# Altium project Controller.PrjPcb (part 3 of 4)

## Sheet Power adapter.SchDoc
size A4; SheetNumber: 3; SheetTotal: 7
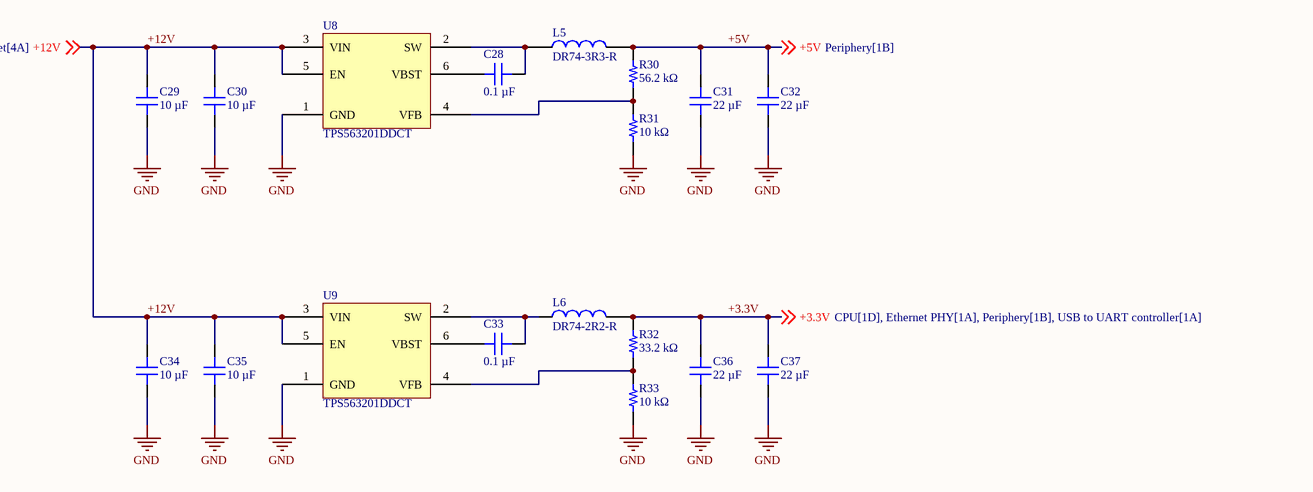
[diagram p2: Power adapter.SchDoc]

### Parts
C28  0.1 µF  [CAP 0603_1608]
C29  10 µF  [CAP 0805_2012]
C30  10 µF  [CAP 0805_2012]
C31  22 µF  [CAP 1206_3216 - 0.8MM]
C32  22 µF  [CAP 1206_3216 - 0.8MM]
C33  0.1 µF  [CAP 0603_1608]
C34  10 µF  [CAP 0805_2012]
C35  10 µF  [CAP 0805_2012]
C36  22 µF  [CAP 1206_3216 - 0.8MM]
C37  22 µF  [CAP 1206_3216 - 0.8MM]
L5  DR74-3R3-R  [INDPM7676X435N]
L6  DR74-2R2-R  [INDPM7676X435N]
R30  56.2 kΩ  [RES 0603_1608]
R31  10 kΩ  [RES 0603_1608]
R32  33.2 kΩ  [RES 0603_1608]
R33  10 kΩ  [RES 0603_1608]
U8  TPS563201DDCT  [TI SOT-23-6 DDC]
U9  TPS563201DDCT  [TI SOT-23-6 DDC]

### Nets
+3.3V: C36.2 C37.2 L6.2 R32.2 ; off-sheet +3.3V
+5V: C31.2 C32.2 L5.2 R30.2 ; off-sheet +5V
+12V: C29.1 C29.2 C30.1 C30.2 C31.1 C32.1 C34.1 C34.2 C35.1 C35.2 C36.1 C37.1 R31.1 R33.1 U8.1(GND) U8.3(VIN) U8.5(EN) U9.1(GND) U9.3(VIN) U9.5(EN) ; off-sheet +12V  [also labelled GND]
NetC28_1: C28.1 L5.1 U8.2(SW)
NetC28_2: C28.2 U8.6(VBST)
NetC33_1: C33.1 L6.1 U9.2(SW)
NetC33_2: C33.2 U9.6(VBST)
NetR30_1: R30.1 R31.2 U8.4(VFB)
NetR32_1: R32.1 R33.2 U9.4(VFB)

### Library data of the parts
C28 C33 = C1608X7R1H104K080AE: CAP CER 0.1UF 50V X7R 0603; manufacturer: TDK Corporation; Tolerance: ±10%; Part Number: C1608X7R1H104K080AE; Capacitance: 0.1 µF; Applications: Boardflex Sensitive; componentlink1description: Datasheet; componentlink1url: https://product.tdk.com/info/en/catalog/datasheets/mlcc_commercial_soft_en.pdf?ref_disty=digikey; componentlink2description: DigiKey Link; componentlink2url: https://www.digikey.com/en/products/detail/tdk-corporation/C1608X7R1H104K080AE/4490564; Device Package: 0603 (1608 Metric); Features: Soft Termination; lastupdated: 9.02.2024 20:10:17; Lifecycle Status: Active; Minimum Order: 1; Mounting Type: Surface Mount, MLCC; Operating Temperature: -55°C ~ 125°C; Package / Case: 0603 (1608 Metric); packaging: TapeAndReel; partid: 12789; Part Status: Active; price: 0.02; series: C; Size / Dimension: 0.063" L x 0.031" W (1.60mm x 0.80mm); Supplier 1: DigiKey; Supplier Part Number 1: 445-15927-6-ND; Temperature Coefficient: X7R; Thickness (Max): 0.037" (0.95mm); value: 0.1 µF; Voltage - Rated: 50V
C29 C30 C34 C35 = CL21B106KOQNNNE: CAP CER 10UF 16V X7R 0805; manufacturer: Samsung Electro-Mechanics; Tolerance: ±10%; Part Number: CL21B106KOQNNNE; Capacitance: 10 µF; Applications: General Purpose; componentlink1description: Datasheet; componentlink1url: http://www.samsungsem.com/kr/support/product-search/mlcc/CL21B106KOQNNNE.jsp; componentlink2description: DigiKey Link; componentlink2url: https://www.digikey.com/en/products/detail/samsung-electro-mechanics/CL21B106KOQNNNE/3888530; Device Package: 0805 (2012 Metric); lastupdated: 9.02.2024 20:15:41; Lifecycle Status: Active; Minimum Order: 1; Mounting Type: Surface Mount, MLCC; Operating Temperature: -55°C ~ 125°C; Package / Case: 0805 (2012 Metric); packaging: TapeAndReel; partid: 40933; Part Status: Active; price: 0.03; series: CL; Size / Dimension: 0.079" L x 0.049" W (2.00mm x 1.25mm); Temperature Coefficient: X7R; Thickness (Max): 0.055" (1.40mm); value: 10 µF; Voltage - Rated: 16V; Supplier 1: DigiKey; Supplier Part Number 1: 1276-2872-1-ND; Supplier 2: TME; Supplier Part Number 2: CL21B106KOQNNNE
C31 C32 C36 C37 = CL31B226KPHNNNE: CAP CER 22UF 10V X7R 1206; manufacturer: Samsung Electro-Mechanics; Tolerance: ±10%; Part Number: CL31B226KPHNNNE; Capacitance: 22 µF; Applications: General Purpose; componentlink1description: Datasheet; componentlink1url: http://www.samsungsem.com/kr/support/product-search/mlcc/CL31B226KPHNNNE.jsp; componentlink2description: DigiKey Link; componentlink2url: https://www.digikey.com/en/products/detail/samsung-electro-mechanics/CL31B226KPHNNNE/3888427; Device Package: 1206 (3216 Metric); lastupdated: 4.06.2024 19:10:41; Lifecycle Status: Active; Minimum Order: 1; Mounting Type: Surface Mount, MLCC; Operating Temperature: -55°C ~ 125°C; Package / Case: 1206 (3216 Metric); packaging: TapeAndReel; partid: 19611; Part Status: Active; price: 0.08; series: CL; Size / Dimension: 0.126" L x 0.063" W (3.20mm x 1.60mm); Supplier 1: DigiKey; Supplier Part Number 1: 1276-2769-1-ND; Temperature Coefficient: X7R; Thickness (Max): 0.071" (1.80mm); value: 22 µF; Voltage - Rated: 10V
L5 = DR74-3R3-R: EATON COILTRONICS - DR74-3R3-R - Power Inductor (SMD), 3.3 H, 3.94 A, Shielded, 5.4 A, DR Series, 7.6mm x 7.6mm x 4.35mm; Manufacturer_Name: Eaton; Manufacturer_Part_Number: DR74-3R3-R; Mouser Part Number: 704-DR74-3R3-R; Mouser Price/Stock: https://www.mouser.co.uk/ProductDetail/Bussmann-Eaton/DR74-3R3-R?qs=yzwxPInThYRgV9ebcXY7Bg%3D%3D; Arrow Part Number: DR74-3R3-R; Arrow Price/Stock: https://www.arrow.com/en/products/dr74-3r3-r/eaton?region=nac; Datasheet Link: https://ms.componentsearchengine.com/Datasheets/2/DR74-3R3-R.pdf; Geometry.Height: 4.35mm; Supplier 1: TME; Supplier Part Number 1: DR74-3R3-R; Supplier 2: Farnell; Supplier Part Number 2: 4437558; Supplier 3: DigiKey; Supplier Part Number 3: 513-1665-6-ND
L6 = DR74-2R2-R: Fixed Inductors 2.2uH 7A 0.0126ohms; Manufacturer_Name: Eaton; Geometry.Height: 4.35mm; Manufacturer_Part_Number: DR74-2R2-R; Mouser Part Number: 704-DR74-2R2-R; Mouser Price/Stock: https://www.mouser.co.uk/ProductDetail/Eaton-Electronics/DR74-2R2-R?qs=yzwxPInThYTMNtV4%252BtE9KA%3D%3D; Arrow Part Number: DR74-2R2-R; Arrow Price/Stock: https://www.arrow.com/en/products/dr74-2r2-r/eaton; Datasheet Link: https://componentsearchengine.com/Datasheets/1/DR74-2R2-R.pdf; Supplier 1: TME; Supplier Part Number 1: DR74-2R2-R; Supplier 2: RS; Supplier Part Number 2: 7701163; Supplier 3: DigiKey; Supplier Part Number 3: 513-1140-6-ND
R30 = CRCW060356K2FKEA: RES SMD 56.2K OHM 1% 1/10W 0603; Manufacturer: Vishay Dale; Power (Watts): 0.1W, 1/10W; Resistance: 56.2 kOhms; Temperature Coefficient: ±100ppm/°C; Part Number: CRCW060356K2FKEA; Value: 56.2 kΩ; ComponentLink1Description: Datasheet; ComponentLink1URL: http://www.vishay.com/docs/20035/dcrcwe3.pdf; ComponentLink2Description: DigiKey Link; ComponentLink2URL: https://www.digikey.com/en/products/detail/vishay-dale/CRCW060356K2FKEA/1174868; Composition: Thick Film; Device Package: 0603 (1608 Metric); Features: Automotive AEC-Q200; Height - Seated (Max): 0.020" (0.50mm); LastUpdated: 9.02.2024 20:43:05; Lifecycle Status: Active; Minimum Order: 1; Number of Terminations: 2; Operating Temperature: -55°C ~ 155°C; Package / Case: 0603 (1608 Metric); Packaging: TapeAndReel; PartId: 12682; Part Status: Active; Price: 0.01; Ratings: AEC-Q200; Series: CRCW; Size / Dimension: 0.061" L x 0.033" W (1.55mm x 0.85mm); Supplier 1: DigiKey; Supplier Part Number 1: 541-56.2KHCT-ND; Supplier Device Package: 0603; Tolerance: ±1%
R31 R33 = CRCW060310K0FKEA: RES SMD 10K OHM 1% 1/10W 0603; Manufacturer: Vishay Dale; Power (Watts): 0.1W, 1/10W; Resistance: 10 kOhms; Temperature Coefficient: ±100ppm/°C; Part Number: CRCW060310K0FKEA; Value: 10 kΩ; ComponentLink1Description: Datasheet; ComponentLink1URL: http://www.vishay.com/docs/20035/dcrcwe3.pdf; ComponentLink2Description: DigiKey Link; ComponentLink2URL: https://www.digikey.com/en/products/detail/vishay-dale/CRCW060310K0FKEA/1174782; Composition: Thick Film; Device Package: 0603 (1608 Metric); Features: Automotive AEC-Q200; Height - Seated (Max): 0.020" (0.50mm); LastUpdated: 9.02.2024 20:42:10; Lifecycle Status: Active; Minimum Order: 1; Number of Terminations: 2; Operating Temperature: -55°C ~ 155°C; Package / Case: 0603 (1608 Metric); Packaging: CutTape; PartId: 24636; Part Status: Active; Price: 0.01; Ratings: AEC-Q200; Series: CRCW; Size / Dimension: 0.061" L x 0.033" W (1.55mm x 0.85mm); Supplier 1: DigiKey; Supplier Part Number 1: 541-10.0KHCT-ND; Supplier Device Package: 0603; Tolerance: ±1%
R32 = CRCW060333K2FKEA: RES SMD 33.2K OHM 1% 1/10W 0603; Manufacturer: Vishay Dale; Power (Watts): 0.1W, 1/10W; Resistance: 33.2 kOhms; Temperature Coefficient: ±100ppm/°C; Part Number: CRCW060333K2FKEA; Value: 33.2 kΩ; ComponentLink1Description: Datasheet; ComponentLink1URL: http://www.vishay.com/docs/20035/dcrcwe3.pdf; ComponentLink2Description: DigiKey Link; ComponentLink2URL: https://www.digikey.com/en/products/detail/vishay-dale/CRCW060333K2FKEA/1174840; Composition: Thick Film; Device Package: 0603 (1608 Metric); Features: Automotive AEC-Q200; Height - Seated (Max): 0.020" (0.50mm); LastUpdated: 9.02.2024 20:43:05; Lifecycle Status: Active; Minimum Order: 1; Number of Terminations: 2; Operating Temperature: -55°C ~ 155°C; Package / Case: 0603 (1608 Metric); Packaging: TapeAndReel; PartId: 12807; Part Status: Active; Price: 0.01; Ratings: AEC-Q200; Series: CRCW; Size / Dimension: 0.061" L x 0.033" W (1.55mm x 0.85mm); Supplier 1: DigiKey; Supplier Part Number 1: 541-33.2KHCT-ND; Supplier Device Package: 0603; Tolerance: ±1%
U8 U9 = TPS563201DDCT: IC REG BUCK ADJ 3A TSOT23-6; Manufacturer: Texas Instruments; Frequency - Switching: 580kHz; Function: Step-Down; Number of Outputs: 1; Output Configuration: Positive; Output Type: Adjustable; Synchronous Rectifier: Yes; Voltage - Input (Max): 17V; Voltage - Input (Min): 4.5V; Voltage - Output (Max): 7V; Voltage - Output (Min/Fixed): 0.768V; Part Number: TPS563201DDCT; ComponentLink1Description: Datasheet; ComponentLink1URL: http://www.ti.com/general/docs/suppproductinfo.tsp?distId=10&gotoUrl=http%3A%2F%2Fwww.ti.com%2Flit%2Fgpn%2Ftps563201; ComponentLink2Description: DigiKey Link; ComponentLink2URL: //digikey.com/product-detail/en/texas-instruments/TPS563201DDCT/296-43393-2-ND/5813458; Current - Output: 3A; Device Package: SOT-23-6 Thin, TSOT-23-6; LastUpdated: 12.12.2019 10:07:22; Lifecycle Status: 0; Minimum Order: 1; Mounting Type: Surface Mount; Operating Temperature: -40°C ~ 125°C (TJ); Package / Case: SOT-23-6 Thin, TSOT-23-6; Packaging: TapeAndReel; Part Status: Active; Price: 0.54; Series: D-CAP2™, Eco-Mode™; Supplier 1: DigiKey; Supplier Part Number 1: 296-43393-2-ND; Supplier Device Package: TSOT-23-6; Topology: Buck

## Sheet Alternate power.SchDoc
size A4; SheetNumber: 4; SheetTotal: 8
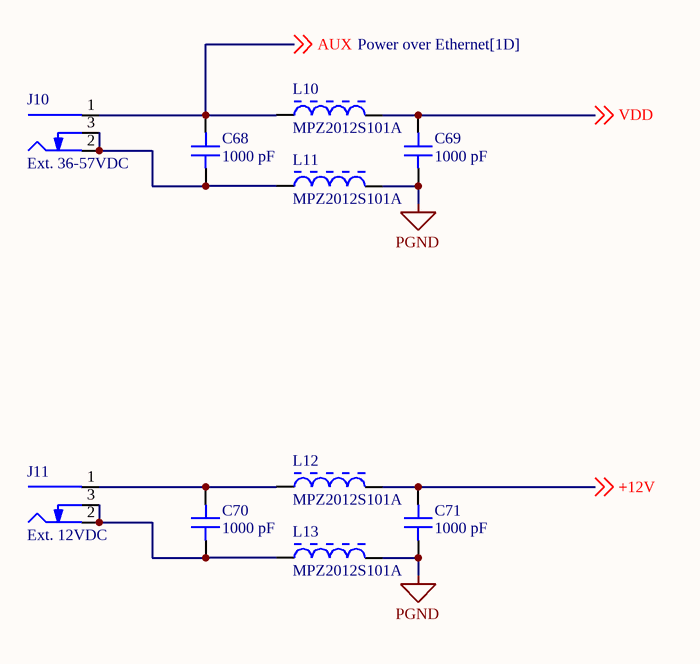
[diagram p3: Alternate power.SchDoc]

### Parts
C68  1000 pF  [CAP 0603_1608]
C69  1000 pF  [CAP 0603_1608]
C70  1000 pF  [CAP 0603_1608]
C71  1000 pF  [CAP 0603_1608]
J10  Ext. 36-57VDC  [CUI PJ-002AH-SMT-TR]
J11  Ext. 12VDC  [CUI PJ-002AH-SMT-TR]
L10  MPZ2012S101A  [TDK-MPZ2012S101A-2_V]
L11  MPZ2012S101A  [TDK-MPZ2012S101A-2_V]
L12  MPZ2012S101A  [TDK-MPZ2012S101A-2_V]
L13  MPZ2012S101A  [TDK-MPZ2012S101A-2_V]

### Nets
+12V: C71.2 L12.2 ; off-sheet +12V
PGND: C69.1 C71.1 L11.2 L13.2
AUX: C68.2 J10.1(Centre) L10.1 ; off-sheet AUX
VDD: C69.2 L10.2 ; off-sheet VDD
NetC68_1: C68.1 J10.2(Outer) J10.3(SW) L11.1
NetC70_1: C70.1 J11.2(Outer) J11.3(SW) L13.1
NetC70_2: C70.2 J11.1(Centre) L12.1

### Library data of the parts
C68-C71 = C1608X7R2A102K080AA: CAP CER 1000PF 100V X7R 0603; manufacturer: TDK Corporation; Tolerance: ±10%; Part Number: C1608X7R2A102K080AA; Capacitance: 1000 pF; Applications: General Purpose; componentlink1description: Datasheet; componentlink1url: https://product.tdk.com/info/en/catalog/datasheets/mlcc_commercial_midvoltage_en.pdf?ref_disty=digikey; componentlink2description: DigiKey Link; componentlink2url: https://www.digikey.com/en/products/detail/tdk-corporation/C1608X7R2A102K080AA/513825; Device Package: 0603 (1608 Metric); lastupdated: 9.02.2024 20:10:29; Lifecycle Status: Active; Minimum Order: 1; Mounting Type: Surface Mount, MLCC; Operating Temperature: -55°C ~ 125°C; Package / Case: 0603 (1608 Metric); packaging: TapeAndReel; partid: 3499; Part Status: Active; price: 0.01; series: C; Size / Dimension: 0.063" L x 0.031" W (1.60mm x 0.80mm); Supplier 1: DigiKey; Supplier Part Number 1: 445-1298-1-ND; Temperature Coefficient: X7R; Thickness (Max): 0.035" (0.90mm); value: 1000 pF; Voltage - Rated: 100V
J10 J11 = PJ-002AH-SMT-TR: CONN PWR JACK 2X5.5MM SOLDER; Manufacturer: CUI Devices; Actual Diameter: 0.079" (2.00mm ID), 0.256" (6.50mm OD); Current Rating (Amps): 5A; Gender: Male; Industry Recognized Mating Diameter: 2.00mm ID (0.079"), 5.50mm OD (0.217"); Internal Switch(s): Single Switch, Normally Closed; Material Flammability Rating: UL94 V-0; Mating Length/Depth: 0.350" (8.90mm); Number of Positions/Contacts: 2 Conductors, 3 Contacts; Shielding: Unshielded; Voltage - Rated: 24VDC; Part Number: PJ-002AH-SMT-TR; ComponentLink1Description: Datasheet; ComponentLink1URL: https://www.cuidevices.com/product/resource/digikeypdf/pj-002ah-smt-tr.pdf; ComponentLink2Description: DigiKey Link; ComponentLink2URL: http://digikey.com/product-detail/en/cui-devices/PJ-002AH-SMT-TR/CP-002AHPJCT-ND/669692; Connector Type: Jack; Features: Board Guide; LastUpdated: 26.05.2020 13:33:39; Lifecycle Status: Active; Minimum Order: 1; Mounting Type: Surface Mount; Packaging: TapeAndReel; Part Status: Active; Price: 0.90; Series: -; Supplier 1: DigiKey; Supplier Part Number 1: CP-002AHPJCT-ND; Termination: Solder
L10-L13 = CMP-2000-05399-1: Chip Bead for Power Line, 100 Ohm, +/- 25%, 4 A, -55 to 125 degC, 0805 (2012 Metric), RoHS, Tape and Reel; Manufacturer: TDK; Maximum DC Resistance: 20mOhms; Test Frequency: 100MHz; Impedance: 100Ohms; Case Width: 1.25mm; Case Length: 2mm; Maximum DC Current: 4A; Case Height: 0.85mm; Package Reference: MPZ2012S101A-2; RoHS: Details; Tolerance: 25%; Operating Temperature Range: -55Cto+125C; Datasheet Version: Jul-13; Dimensions: 1.25mmWx2mmLx0.85mmH; Product: FerriteChipBeads; Termination Style: SMD/SMT; Datasheet URL: http://www.farnell.com/datasheets/1750041.pdf; Factory Pack Quantity: 4000; Brand: TDK; Packaging: Reel; Package Description: 2-Pin Surface Mount Device, Body 2 x 1.25 mm; Product Category: EMIFilterBeads,Chips&Arrays; Manufacturer URL: http://www.tdk.com/; Package / Case: 0805(2012metric)

## Sheet Ethernet PHY.SchDoc
size A4; SheetNumber: 5; SheetTotal: 8
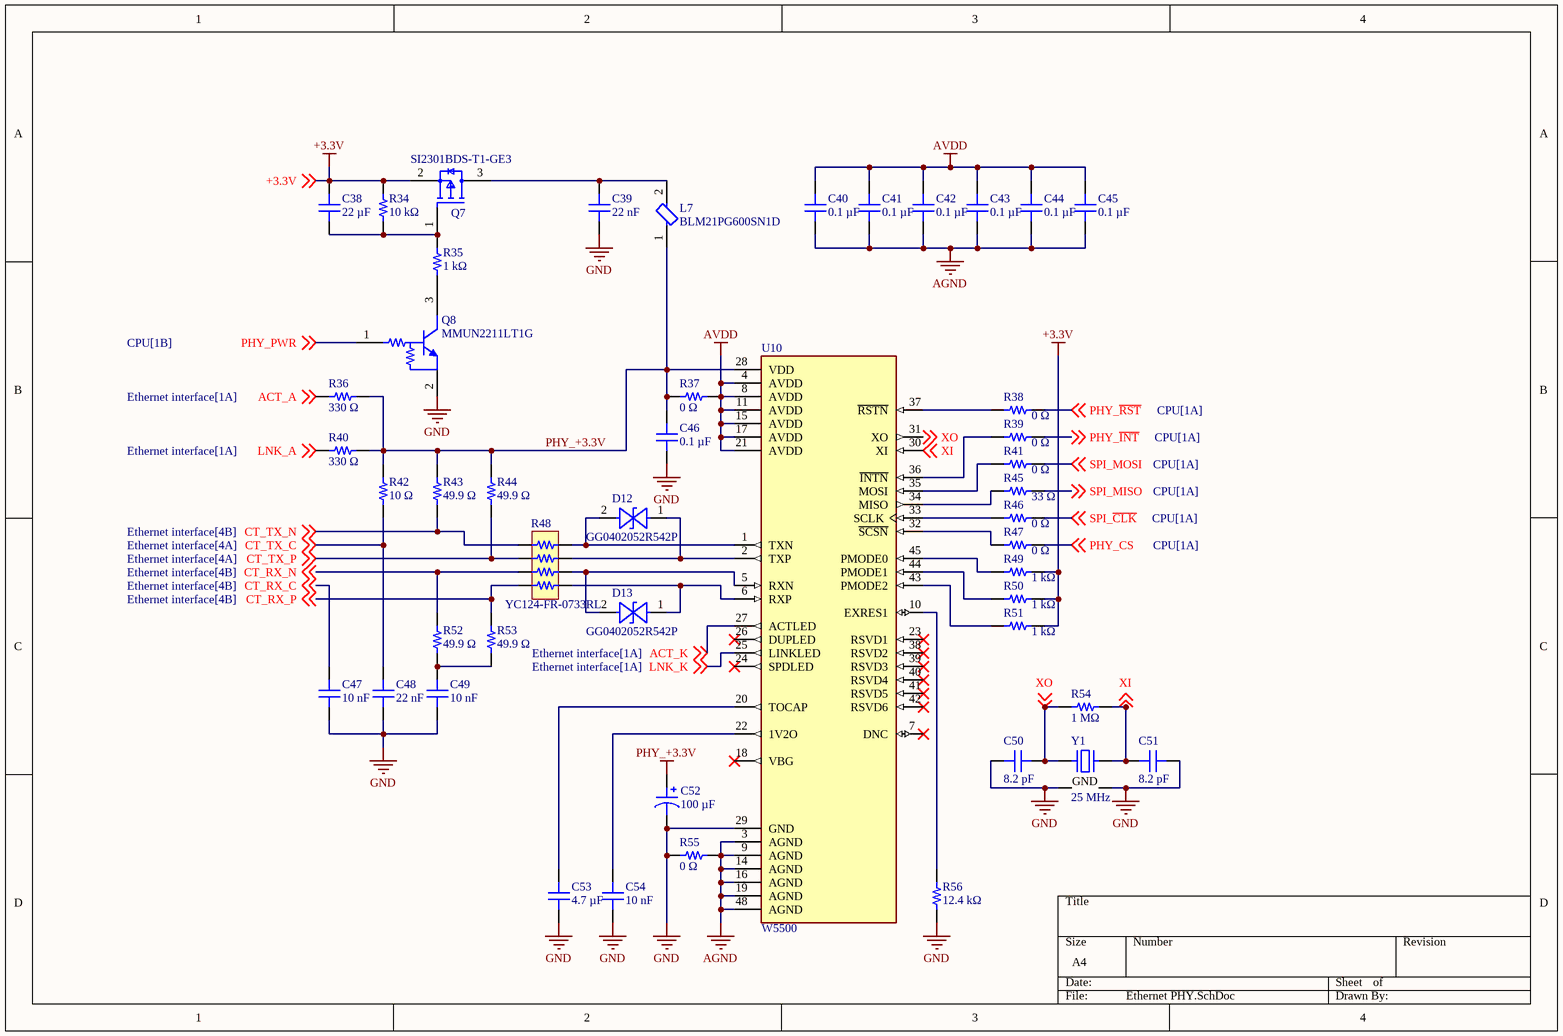
[diagram p4: Ethernet PHY.SchDoc]

### Parts
C38  22 µF  [MURATA GRM188 0603_1608]
C39  Capacitance: 22 nF  [CAP 0603_1608]  (hidden comment: 0.022 µF)
C40  0.1 µF  [CAP 0603_1608]
C41  0.1 µF  [CAP 0603_1608]
C42  0.1 µF  [CAP 0603_1608]
C43  0.1 µF  [CAP 0603_1608]
C44  0.1 µF  [CAP 0603_1608]
C45  0.1 µF  [CAP 0603_1608]
C46  0.1 µF  [CAP 0603_1608]
C47  Capacitance: 10 nF  [CAP 0603_1608]  (hidden comment: 10000 pF)
C48  Capacitance: 22 nF  [CAP 0603_1608]  (hidden comment: 0.022 µF)
C49  Capacitance: 10 nF  [CAP 0603_1608]  (hidden comment: 10000 pF)
C50  8.2 pF  [CAP 0603_1608]
C51  8.2 pF  [CAP 0603_1608]
C52  100 µF  [CAP POL 1411_3528]
C53  4.7 µF  [CAP 0603_1608]
C54  Capacitance: 10 nF  [CAP 0603_1608]  (hidden comment: 10000 pF)
D12  GG0402052R542P  [TVS_GG0402_KAV]
D13  GG0402052R542P  [TVS_GG0402_KAV]
L7  BLM21PG600SN1D  [FP-BLM21-0_2-t0_85-e0_5-d-IPC_A]
Q7  SI2301BDS-T1-GE3  [FP-S-03946-MFG]
Q8  MMUN2211LT1G  [ONSC-SOT-23-3-318-08_V]
R34  10 kΩ  [RES 0603_1608]
R35  1 kΩ  [RES 0603_1608]
R36  330 Ω  [RES 0603_1608]
R37  0 Ω  [RES 0603_1608]
R38  0 Ω  [RES 0603_1608]
R39  0 Ω  [RES 0603_1608]
R40  330 Ω  [RES 0603_1608]
R41  0 Ω  [RES 0603_1608]
R42  10 Ω  [RES 0603_1608]
R43  49.9 Ω  [RES 0603_1608]
R44  49.9 Ω  [RES 0603_1608]
R45  33 Ω  [RES 0603_1608]
R46  0 Ω  [RES 0603_1608]
R47  0 Ω  [RES 0603_1608]
R48  YC124-FR-0733RL  [RESNET 0804-8 CONVEX]
R49  1 kΩ  [RES 0603_1608]
R50  1 kΩ  [RES 0603_1608]
R51  1 kΩ  [RES 0603_1608]
R52  49.9 Ω  [RES 0603_1608]
R53  49.9 Ω  [RES 0603_1608]
R54  1 MΩ  [RES 0603_1608]
R55  0 Ω  [RES 0603_1608]
R56  12.4 kΩ  [RES 0603_1608]
U10  W5500  [LQFP-48N]
Y1  25 MHz  [NDK NX2520SA]

### Nets
+3.3V: C38.2 Q7.2(S) R34.2 R49.2 R50.2 R51.2 ; off-sheet +3.3V
AGND: C40.1 C41.1 C42.1 C43.1 C44.1 C45.1 R55.2 U10.3(AGND) U10.9(AGND) U10.14(AGND) U10.16(AGND) U10.19(AGND) U10.48(AGND)
AVDD: C40.2 C41.2 C42.2 C43.2 C44.2 C45.2 R37.2 U10.4(AVDD) U10.8(AVDD) U10.11(AVDD) U10.15(AVDD) U10.17(AVDD) U10.21(AVDD)
GND: C39.1 C46.1 C47.2 C48.1 C49.2 C50.2 C51.1 C52.2 C53.1 C54.2 Q8.2(E) R55.1 R56.1 U10.29(GND) Y1.2(GND) Y1.4(GND)  [project net +12V]
PHY_+3.3V: C46.2 C52.1 L7.1 R36.2 R37.1 R40.2 R42.2 R43.2 R44.2 U10.28(VDD)
ACT_A: R36.1 ; off-sheet ACT_A
ACT_K: U10.27(ACTLED) ; off-sheet ACT_K
CT_RX_C: C47.1 ; off-sheet CT_RX_C
CT_RX_N: R48.3 R52.2 ; off-sheet CT_RX_N
CT_RX_P: R48.4 R53.2 ; off-sheet CT_RX_P
CT_TX_C: C48.2 R42.1 ; off-sheet CT_TX_C
CT_TX_N: R43.1 R48.1 ; off-sheet CT_TX_N
CT_TX_P: R44.1 R48.2 ; off-sheet CT_TX_P
LNK_A: R40.1 ; off-sheet LNK_A
LNK_K: U10.25(LINKLED) ; off-sheet LNK_K
PHY_CS: R47.2 ; off-sheet PHY_CS
PHY_~{INT}: R39.2 ; off-sheet PHY_~{INT}
PHY_PWR: Q8.1(B) ; off-sheet PHY_PWR
PHY_~{RST}: R38.2 ; off-sheet PHY_~{RST}
SPI_~{CLK}: R46.2 ; off-sheet SPI_~{CLK}
SPI_MISO: R45.2 ; off-sheet SPI_MISO
SPI_MOSI: R41.2 ; off-sheet SPI_MOSI
XI: C51.2 R54.2 U10.30(XI) Y1.3 ; off-sheet XI
XO: C50.1 R54.1 U10.31(XO) Y1.1 ; off-sheet XO
NetC38_1: C38.1 Q7.1(G) R34.1 R35.2
NetC39_2: C39.2 L7.2 Q7.3(D)
NetC49_1: C49.1 R52.1 R53.1
NetC53_2: C53.2 U10.20(TOCAP)
NetC54_1: C54.1 U10.22(1V2O)
NetD12_1: D12.1(ANODECATHODE) R48.7 U10.2(TXP)
NetD12_2: D12.2(CATHODEANODE) R48.8 U10.1(TXN)
NetD13_1: D13.1(ANODECATHODE) R48.5 U10.6(RXP)
NetD13_2: D13.2(CATHODEANODE) R48.6 U10.5(RXN)
NetQ8_3: Q8.3(C) R35.1
NetR38_1: R38.1 U10.37(~{RSTN})
NetR39_1: R39.1 U10.36(~{INTN})
NetR41_1: R41.1 U10.35(MOSI)
NetR45_1: R45.1 U10.34(MISO)
NetR46_1: R46.1 U10.33(SCLK)
NetR47_1: R47.1 U10.32(~{SCSN})
NetR49_1: R49.1 U10.45(PMODE0)
NetR50_1: R50.1 U10.44(PMODE1)
NetR51_1: R51.1 U10.43(PMODE2)
NetR56_2: R56.2 U10.10(EXRES1)

Not connected (* = marked no-connect by the designer): U10 7(DNC)* 18(VBG)* 23(RSVD1)* 24(SPDLED)* 26(DUPLED)* 38(RSVD2)* 39(RSVD3)* 40(RSVD4)* 41(RSVD5)* 42(RSVD6)*

### Library data of the parts
C38 = GRM186R60J226ME15D: CAP CER 22UF 6.3V X5R 0603; manufacturer: Murata Electronics; Tolerance: ±20%; Part Number: GRM186R60J226ME15D; Capacitance: 22 µF; Applications: General Purpose; componentlink1description: Datasheet; componentlink1url: https://psearch.en.murata.com/capacitor/product/GRM186R60J226ME15%23.pdf; componentlink2description: DigiKey Link; componentlink2url: https://www.digikey.com/en/products/detail/murata-electronics/GRM186R60J226ME15D/5877404; Device Package: 0603 (1608 Metric); lastupdated: 20.07.2024 00:23:22; Lifecycle Status: Active; Minimum Order: 1; Mounting Type: Surface Mount, MLCC; Operating Temperature: -55°C ~ 85°C; Package / Case: 0603 (1608 Metric); packaging: TapeAndReel; partid: 2353; Part Status: Active; price: 0.05; series: GRM; Size / Dimension: 0.063" L x 0.031" W (1.60mm x 0.80mm); Supplier 1: DigiKey; Supplier Part Number 1: 490-13241-1-ND; Temperature Coefficient: X5R; Thickness (Max): 0.024" (0.60mm); value: 22 µF; Voltage - Rated: 6.3V
C39 C48 = C1608X7R1H223K080AE: CAP CER 0.022UF 50V X7R 0603; manufacturer: TDK Corporation; Tolerance: ±10%; Part Number: C1608X7R1H223K080AE; Applications: Boardflex Sensitive; componentlink1description: Datasheet; componentlink1url: https://product.tdk.com/info/en/catalog/datasheets/mlcc_commercial_soft_en.pdf?ref_disty=digikey; componentlink2description: DigiKey Link; componentlink2url: https://www.digikey.com/en/products/detail/tdk-corporation/C1608X7R1H223K080AE/5809178; Device Package: 0603 (1608 Metric); Features: Soft Termination; lastupdated: 9.02.2024 20:10:18; Lifecycle Status: Active; Minimum Order: 1; Mounting Type: Surface Mount, MLCC; Operating Temperature: -55°C ~ 125°C; Package / Case: 0603 (1608 Metric); packaging: TapeAndReel; partid: 11617; Part Status: Active; price: 0.02; series: C; Size / Dimension: 0.063" L x 0.031" W (1.60mm x 0.80mm); Supplier 1: DigiKey; Supplier Part Number 1: 445-173613-1-ND; Temperature Coefficient: X7R; Thickness (Max): 0.035" (0.90mm); value: 0.022 µF; Voltage - Rated: 50V
C40-C46 = C1608X7R1H104K080AE: as C28 on sheet Power adapter; Part Number: C1608X7R1H104K080AE; Capacitance: 0.1 µF; Applications: Boardflex Sensitive; componentlink1description: Datasheet; componentlink1url: https://product.tdk.com/info/en/catalog/datasheets/mlcc_commercial_soft_en.pdf?ref_disty=digikey; componentlink2description: DigiKey Link; componentlink2url: https://www.digikey.com/en/products/detail/tdk-corporation/C1608X7R1H104K080AE/4490564; Device Package: 0603 (1608 Metric); Features: Soft Termination; lastupdated: 9.02.2024 20:10:17; Lifecycle Status: Active; Minimum Order: 1; Mounting Type: Surface Mount, MLCC; Operating Temperature: -55°C ~ 125°C; Package / Case: 0603 (1608 Metric); packaging: TapeAndReel; partid: 12789; Part Status: Active; price: 0.02; series: C; Size / Dimension: 0.063" L x 0.031" W (1.60mm x 0.80mm); Supplier 1: DigiKey; Supplier Part Number 1: 445-15927-6-ND; Temperature Coefficient: X7R; Thickness (Max): 0.037" (0.95mm); value: 0.1 µF; Voltage - Rated: 50V
C47 C49 C54 = C1608X7R1H103K080AE: CAP CER 10000PF 50V X7R 0603; manufacturer: TDK Corporation; Tolerance: ±10%; Part Number: C1608X7R1H103K080AE; Applications: Boardflex Sensitive; componentlink1description: Datasheet; componentlink1url: https://product.tdk.com/info/en/catalog/datasheets/mlcc_commercial_soft_en.pdf?ref_disty=digikey; componentlink2description: DigiKey Link; componentlink2url: https://www.digikey.com/en/products/detail/tdk-corporation/C1608X7R1H103K080AE/4490562; Device Package: 0603 (1608 Metric); Features: Soft Termination; lastupdated: 9.02.2024 20:10:18; Lifecycle Status: Active; Minimum Order: 1; Mounting Type: Surface Mount, MLCC; Operating Temperature: -55°C ~ 125°C; Package / Case: 0603 (1608 Metric); packaging: TapeAndReel; partid: 11552; Part Status: Active; price: 0.02; series: C; Size / Dimension: 0.063" L x 0.031" W (1.60mm x 0.80mm); Supplier 1: DigiKey; Supplier Part Number 1: 445-15925-1-ND; Temperature Coefficient: X7R; Thickness (Max): 0.037" (0.95mm); value: 10000 pF; Voltage - Rated: 50V
C50 C51 = C0603C829B5GACAUTO: CAP CER 8.2PF 50V C0G/NP0 0603; manufacturer: KEMET; Temperature Coefficient: C0G, NP0; Tolerance: ±0.1pF; Part Number: C0603C829B5GACAUTO; Capacitance: 8.2 pF; Applications: Automotive; componentlink1description: Datasheet; componentlink1url: https://connect.kemet.com:7667/gateway/IntelliData-ComponentDocumentation/1.0/download/datasheet/C0603C829B5GACAUTO; componentlink2description: DigiKey Link; componentlink2url: https://www.digikey.com/en/products/detail/kemet/C0603C829B5GACAUTO/13905616; Device Package: 0603 (1608 Metric); Features: Low ESL; lastupdated: 9.02.2024 20:08:38; Lifecycle Status: Active; Minimum Order: 1; Mounting Type: Surface Mount, MLCC; Operating Temperature: -55°C ~ 125°C; Package / Case: 0603 (1608 Metric); packaging: TapeAndReel; partid: 56799; price: 0.13; Ratings: AEC-Q200; series: SMD Auto C0G; Size / Dimension: 0.063" L x 0.031" W (1.60mm x 0.80mm); Supplier 1: DigiKey; Supplier Part Number 1: 399-C0603C829B5GACAUTOCT-ND; Thickness (Max): 0.034" (0.87mm); value: 8.2 pF; Voltage - Rated: 50V
C52 = T494B107M006AT: CAP TANT 100UF 20% 6.3V 1411; manufacturer: KEMET; Manufacturer Size Code: B; ESR (Equivalent Series Resistance): 1.5Ohm; Lifetime @ Temp.: 2000 Hrs @ 125°C; Type: Molded; Part Number: T494B107M006AT; Value: 100 µF; Capacitance: 100 µF; componentlink1description: Datasheet; componentlink1url: https://api.kemet.com/component-edge/download/datasheet/T494B107M006AT.pdf; componentlink2description: DigiKey Link; componentlink2url: https://www.digikey.com/en/products/detail/kemet/T494B107M006AT/818693; Device Package: 1411 (3528 Metric); Features: General Purpose; Height - Seated (Max): 0.083" (2.10mm); lastupdated: 3.06.2024 19:29:03; Lifecycle Status: Active; Minimum Order: 1; Mounting Type: Surface Mount; Operating Temperature: -55°C ~ 125°C; Package / Case: 1411 (3528 Metric); packaging: TapeAndReel; partid: 7; Part Status: Active; price: 0.49; series: T494; Size / Dimension: 0.138" L x 0.110" W (3.50mm x 2.80mm); Supplier 1: DigiKey; Supplier Part Number 1: 399-3833-1-ND; Tolerance: ±20%; Voltage - Rated: 6.3 V
C53 = CL10A475KP8NNNC: CAP CER 4.7UF 10V X5R 0603; manufacturer: Samsung Electro-Mechanics; Tolerance: ±10%; Part Number: CL10A475KP8NNNC; Capacitance: 4.7 µF; Applications: General Purpose; componentlink1description: Datasheet; componentlink1url: http://www.samsungsem.com/kr/support/product-search/mlcc/CL10A475KP8NNNC.jsp; componentlink2description: DigiKey Link; componentlink2url: https://www.digikey.com/en/products/detail/samsung-electro-mechanics/CL10A475KP8NNNC/3886702; Device Package: 0603 (1608 Metric); lastupdated: 9.02.2024 20:10:26; Lifecycle Status: Active; Minimum Order: 1; Mounting Type: Surface Mount, MLCC; Operating Temperature: -55°C ~ 85°C; Package / Case: 0603 (1608 Metric); packaging: TapeAndReel; partid: 5671; Part Status: Active; price: 0.01; series: CL; Size / Dimension: 0.063" L x 0.031" W (1.60mm x 0.80mm); Supplier 1: DigiKey; Supplier Part Number 1: 1276-1044-1-ND; Temperature Coefficient: X5R; Thickness (Max): 0.035" (0.90mm); value: 4.7 µF; Voltage - Rated: 10V
D12 D13 = GG0402052R542P: Description; Manufacturer_Name: KYOCERA AVX; Copyright: Copyright (C) 2025 Ultra Librarian. All rights reserved.; Manufacturer_Part_Number: GG0402052R542P
  D12: Supplier 1: DigiKey; Supplier Part Number 1: 478-10592-1-ND
L7 = CMP-0686-00616-3: Chip Ferrite Bead, 0805, 60Ω @ 100MHz, 0.02Ω, 25%, 3.5A; DC Resistance-Max: 20mR; Number of Circuits: 1; Impedance: 60R; DC Current: 3A; Shielding: Unshielded; Material: Steel; Military Standard: Not; DC Resistance (DCR): 20mR; Core Material: Ferrite; Termination: SMD/SMT; Max Operating Temperature: 125°C; Max Current Rating: 3.5A; Length: 2mm; Packaging: Tape and Reel; Case Code (Metric): 2012; Series: BLM21P; REACH SVHC: No SVHC; Width: 1.25mm; Current Rating: 3.5A; Height: 0.85mm; RoHS Compliant: Yes; Case Code (Imperial): 0805; Radiation Hardening: No; Frequency: 100MHz; Package Quantity: 1; Depth: 1.25mm; Tolerance: 25%; Number of Lines: 1; Lead Free: Lead Free; Case/Package: 0805; Min Operating Temperature: -55°C; Max DC Current: 3A; Number of Pins: 2; Test Frequency: 100MHz
Q7 = CMP-00030-42864886-1: SI2301BDS-T1-GE3 Trans Mosfet P-ch Si 20V 2.2A 3-PIN SOT-23 T/r / Mosfet P-ch 20V 2.2A SOT23-3; Rise Time: 40ns; Nominal Vgs: -950mV; Gate to Source Voltage (Vgs): 8V; Element Configuration: Single; Number of Channels: 1; Power Dissipation: 700mW; Resistance: 100MΩ; Continuous Drain Current (ID): -2.2A; Drain to Source Breakdown Voltage: -20V; Turn-On Delay Time: 20ns; Turn-Off Delay Time: 30ns; Input Capacitance: 375pF; Schedule B: 8541210080, 8541210080; Length: 3.04mm; Height: 1.02mm; Radiation Hardening: No; RoHS: Compliant; NexarPartId: 42864886; Number of Pins: 3; Weight: 1.437803g; Mount: Surface Mount; Min Operating Temperature: -55°C; Number of Elements: 1; Drain to Source Resistance: 100mΩ; Max Power Dissipation: 700mW; Threshold Voltage: -950mV; Lead Free: Lead Free; Rds On Max: 100mΩ; Width: 1.4mm; REACH SVHC: Unknown; Fall Time: 40ns; Max Operating Temperature: 150°C; Drain to Source Voltage (Vdss): -20V; Case/Package: SOT-23-3
Q8 = CMP-0630-00041-1: Digital Transistor (BRT), R1=10 kOhm, R2=10 kOhm, NPN Transistor, 3-Pin SOT-23, Pb-Free, Tape and Reel; PartNumber: SMMUN2211LT1G; Manufacturer: On Semiconductor; hFE Min: 35; V(BR)CEO Min (V): 50; R1/R2 Typ: 1; IC Continuous (A): 0.1; DatasheetVersion: Rev. 5; Polarity: NPN; ComponentLink3Description: Package Specification; ComponentLink3URL: http://www.onsemi.cn/pub_link/Collateral/318-08.PDF; Mounting Technology: Surface Mount; ComponentLink2Description: Datasheet; PackageReference: SOT-23-3-318-08; ComponentLink1URL: http://www.onsemi.com/; Packing: Tape and Reel; RoHS: TRUE; ComponentLink2URL: http://www.onsemi.cn/pub_link/Collateral/DTC114E-D.PDF; PackageVersion: Rev. AP, 11/2009; ComponentLink1Description: Manufacturer URL; PackageDescription: 3-Pin Small Outline Transistor, Body 2.92 x 1.3 mm, Pitch 0.95 mm
R34 = CRCW060310K0FKEA: as R31 on sheet Power adapter; Part Number: CRCW060310K0FKEA; Value: 10 kΩ; ComponentLink1Description: Datasheet; ComponentLink1URL: http://www.vishay.com/docs/20035/dcrcwe3.pdf; ComponentLink2Description: DigiKey Link; ComponentLink2URL: https://www.digikey.com/en/products/detail/vishay-dale/CRCW060310K0FKEA/1174782; Composition: Thick Film; Device Package: 0603 (1608 Metric); Features: Automotive AEC-Q200; Height - Seated (Max): 0.020" (0.50mm); LastUpdated: 9.02.2024 20:42:10; Lifecycle Status: Active; Minimum Order: 1; Number of Terminations: 2; Operating Temperature: -55°C ~ 155°C; Package / Case: 0603 (1608 Metric); Packaging: CutTape; PartId: 24636; Part Status: Active; Price: 0.01; Ratings: AEC-Q200; Series: CRCW; Size / Dimension: 0.061" L x 0.033" W (1.55mm x 0.85mm); Supplier 1: DigiKey; Supplier Part Number 1: 541-10.0KHCT-ND; Supplier Device Package: 0603; Tolerance: ±1%
R35 R49-R51 = CRCW06031K00FKEA: RES SMD 1K OHM 1% 1/10W 0603; Manufacturer: Vishay Dale; Power (Watts): 0.1W, 1/10W; Resistance: 1 kOhms; Temperature Coefficient: ±100ppm/°C; Part Number: CRCW06031K00FKEA; Value: 1 kΩ; ComponentLink1Description: Datasheet; ComponentLink1URL: http://www.vishay.com/docs/20035/dcrcwe3.pdf; ComponentLink2Description: DigiKey Link; ComponentLink2URL: https://www.digikey.com/en/products/detail/vishay-dale/CRCW06031K00FKEA/1174668; Composition: Thick Film; Device Package: 0603 (1608 Metric); Features: Automotive AEC-Q200; Height - Seated (Max): 0.020" (0.50mm); LastUpdated: 9.02.2024 20:42:10; Lifecycle Status: Active; Minimum Order: 1; Number of Terminations: 2; Operating Temperature: -55°C ~ 155°C; Package / Case: 0603 (1608 Metric); Packaging: CutTape; PartId: 24637; Part Status: Active; Price: 0.01; Ratings: AEC-Q200; Series: CRCW; Size / Dimension: 0.061" L x 0.033" W (1.55mm x 0.85mm); Supplier 1: DigiKey; Supplier Part Number 1: 541-1.00KHCT-ND; Supplier Device Package: 0603; Tolerance: ±1%
R36 R40 = CRCW0603330RFKEA: RES SMD 330 OHM 1% 1/10W 0603; Manufacturer: Vishay Dale; Power (Watts): 0.1W, 1/10W; Temperature Coefficient: ±100ppm/°C; Part Number: CRCW0603330RFKEA; Value: 330 Ω; ComponentLink1Description: Datasheet; ComponentLink1URL: http://www.vishay.com/docs/20035/dcrcwe3.pdf; ComponentLink2Description: DigiKey Link; ComponentLink2URL: https://www.digikey.com/en/products/detail/vishay-dale/CRCW0603330RFKEA/1174611; Composition: Thick Film; Device Package: 0603 (1608 Metric); Features: Automotive AEC-Q200; Height - Seated (Max): 0.020" (0.50mm); LastUpdated: 9.02.2024 20:43:06; Lifecycle Status: Active; Minimum Order: 1; Number of Terminations: 2; Operating Temperature: -55°C ~ 155°C; Package / Case: 0603 (1608 Metric); Packaging: CutTape; PartId: 12596; Part Status: Active; Price: 0.01; Ratings: AEC-Q200; Resistance: 330 Ω; Series: CRCW; Size / Dimension: 0.061" L x 0.033" W (1.55mm x 0.85mm); Supplier 1: DigiKey; Supplier Part Number 1: 541-330HCT-ND; Supplier Device Package: 0603; Tolerance: ±1%
R37-R39 R41 R46 R47 R55 = ERJ-3GEY0R00V: RES SMD 0 OHM JUMPER 1/10W 0603; Manufacturer: Panasonic Electronic Components; Power (Watts): 0.1W, 1/10W; Part Number: ERJ-3GEY0R00V; Value: 0 Ω; ComponentLink1Description: Datasheet; ComponentLink1URL: http://industrial.panasonic.com/www-cgi/jvcr13pz.cgi?E+PZ+3+AOA0001+ERJ3GEY0R00V+7+WW; ComponentLink2Description: DigiKey Link; ComponentLink2URL: https://www.digikey.com/en/products/detail/panasonic-electronic-components/ERJ-3GEY0R00V/135656; Composition: Thick Film; Device Package: 0603 (1608 Metric); Features: Automotive AEC-Q200; Height - Seated (Max): 0.022" (0.55mm); LastUpdated: 9.02.2024 20:42:26; Lifecycle Status: Active; Minimum Order: 1; Number of Terminations: 2; Operating Temperature: -55°C ~ 155°C; Package / Case: 0603 (1608 Metric); Packaging: CutTape; PartId: 22603; Part Status: Active; Price: 0.01; Ratings: AEC-Q200; Resistance: 0 Ω; Series: ERJ-3G; Size / Dimension: 0.063" L x 0.031" W (1.60mm x 0.80mm); Supplier 1: DigiKey; Supplier Part Number 1: P0.0GCT-ND; Supplier Device Package: 0603; Tolerance: Jumper
R42 = CRCW060310R0FKEA: RES SMD 10 OHM 1% 1/10W 0603; Manufacturer: Vishay Dale; Power (Watts): 0.1W, 1/10W; Temperature Coefficient: ±100ppm/°C; Part Number: CRCW060310R0FKEA; Value: 10 Ω; ComponentLink1Description: Datasheet; ComponentLink1URL: http://www.vishay.com/docs/20035/dcrcwe3.pdf; ComponentLink2Description: DigiKey Link; ComponentLink2URL: https://www.digikey.com/en/products/detail/vishay-dale/CRCW060310R0FKEA/1174440; Composition: Thick Film; Device Package: 0603 (1608 Metric); Features: Automotive AEC-Q200; Height - Seated (Max): 0.020" (0.50mm); LastUpdated: 9.02.2024 20:43:06; Lifecycle Status: Active; Minimum Order: 1; Number of Terminations: 2; Operating Temperature: -55°C ~ 155°C; Package / Case: 0603 (1608 Metric); Packaging: CutTape; PartId: 12592; Part Status: Active; Price: 0.01; Ratings: AEC-Q200; Resistance: 10 Ω; Series: CRCW; Size / Dimension: 0.061" L x 0.033" W (1.55mm x 0.85mm); Supplier 1: DigiKey; Supplier Part Number 1: 541-10.0HCT-ND; Supplier Device Package: 0603; Tolerance: ±1%
R43 R44 R52 R53 = CRCW060349R9FKEA: RES SMD 49.9 OHM 1% 1/10W 0603; Manufacturer: Vishay Dale; Power (Watts): 0.1W, 1/10W; Temperature Coefficient: ±100ppm/°C; Part Number: CRCW060349R9FKEA; Value: 49.9 Ω; ComponentLink1Description: Datasheet; ComponentLink1URL: http://www.vishay.com/docs/20035/dcrcwe3.pdf; ComponentLink2Description: DigiKey Link; ComponentLink2URL: https://www.digikey.com/en/products/detail/vishay-dale/CRCW060349R9FKEA/1174519; Composition: Thick Film; Device Package: 0603 (1608 Metric); Features: Automotive AEC-Q200; Height - Seated (Max): 0.020" (0.50mm); LastUpdated: 9.02.2024 20:43:05; Lifecycle Status: Active; Minimum Order: 1; Number of Terminations: 2; Operating Temperature: -55°C ~ 155°C; Package / Case: 0603 (1608 Metric); Packaging: CutTape; PartId: 12704; Part Status: Active; Price: 0.01; Ratings: AEC-Q200; Resistance: 49.9 Ω; Series: CRCW; Size / Dimension: 0.061" L x 0.033" W (1.55mm x 0.85mm); Supplier 1: DigiKey; Supplier Part Number 1: 541-49.9HCT-ND; Supplier Device Package: 0603; Tolerance: ±1%
R45 = RMCF0603FT33R0: RES 33 OHM 1% 1/10W 0603; Manufacturer: Stackpole Electronics Inc; Power (Watts): 0.1W, 1/10W; Temperature Coefficient: ±100ppm/°C; Part Number: RMCF0603FT33R0; Value: 33 Ω; ComponentLink1Description: Datasheet; ComponentLink1URL: https://www.seielect.com/catalog/sei-rmcf_rmcp.pdf; ComponentLink2Description: DigiKey Link; ComponentLink2URL: https://www.digikey.com/en/products/detail/stackpole-electronics-inc/RMCF0603FT33R0/1760804; Composition: Thick Film; Device Package: 0603 (1608 Metric); Features: Automotive AEC-Q200; Height - Seated (Max): 0.022" (0.55mm); LastUpdated: 9.02.2024 20:42:27; Lifecycle Status: Active; Minimum Order: 1; Number of Terminations: 2; Operating Temperature: -55°C ~ 155°C; Package / Case: 0603 (1608 Metric); Packaging: CutTape; PartId: 22548; Part Status: Active; Price: 0.01; Ratings: AEC-Q200; Resistance: 33 Ω; Series: RMCF; Size / Dimension: 0.061" L x 0.031" W (1.55mm x 0.80mm); Supplier 1: DigiKey; Supplier Part Number 1: RMCF0603FT33R0CT-ND; Supplier Device Package: 0603; Tolerance: ±1%
R48 = YC124-FR-0733RL: RES ARRAY 4 RES 33 OHM 0804; Manufacturer: Yageo; Circuit Type: Isolated; Number of Resistors: 4; Power Per Element: 62.5mW; Resistance (Ohms): 33; Temperature Coefficient: ±200ppm/°C; Tolerance: ±1%; Part Number: YC124-FR-0733RL; Applications: DDRAM, SDRAM; ComponentLink1Description: Datasheet; ComponentLink1URL: https://www.yageo.com/upload/media/product/productsearch/datasheet/rchip/PYu-YC_TC_group_51_RoHS_L_9.pdf; ComponentLink2Description: DigiKey Link; ComponentLink2URL: https://www.digikey.com/en/products/detail/yageo/YC124-FR-0733RL/2827646; Height - Seated (Max): 0.022" (0.55mm); LastUpdated: 3.06.2024 20:05:56; Lifecycle Status: Active; Minimum Order: 1; Mounting Type: Surface Mount; Number of Pins: 8; Operating Temperature: -55°C ~ 155°C; Package / Case: 0804, Convex, Long Side Terminals; Packaging: TapeAndReel; PartId: 502; Part Status: Active; Price: 0.03; Series: YC124; Size / Dimension: 0.079" L x 0.039" W (2.00mm x 1.00mm); Supplier 1: DigiKey; Supplier Part Number 1: YC124F-33CT-ND
R54 = CRCW06031M00FKEA: RES SMD 1M OHM 1% 1/10W 0603; Manufacturer: Vishay Dale; Power (Watts): 0.1W, 1/10W; Temperature Coefficient: ±100ppm/°C; Part Number: CRCW06031M00FKEA; Value: 1 MΩ; ComponentLink1Description: Datasheet; ComponentLink1URL: http://www.vishay.com/docs/20035/dcrcwe3.pdf; ComponentLink2Description: DigiKey Link; ComponentLink2URL: https://www.digikey.com/en/products/detail/vishay-dale/CRCW06031M00FKEA/1175010; Composition: Thick Film; Device Package: 0603 (1608 Metric); Features: Automotive AEC-Q200; Height - Seated (Max): 0.020" (0.50mm); LastUpdated: 9.02.2024 20:43:06; Lifecycle Status: Active; Minimum Order: 1; Number of Terminations: 2; Operating Temperature: -55°C ~ 155°C; Package / Case: 0603 (1608 Metric); Packaging: TapeAndReel; PartId: 12567; Part Status: Active; Price: 0.01; Ratings: AEC-Q200; Resistance: 1 MΩ; Series: CRCW; Size / Dimension: 0.061" L x 0.033" W (1.55mm x 0.85mm); Supplier 1: DigiKey; Supplier Part Number 1: 541-1.00MHCT-ND; Supplier Device Package: 0603; Tolerance: ±1%
R56 = CRCW060312K4FKEA: RES SMD 12.4K OHM 1% 1/10W 0603; Manufacturer: Vishay Dale; Power (Watts): 0.1W, 1/10W; Resistance: 12.4 kOhms; Temperature Coefficient: ±100ppm/°C; Part Number: CRCW060312K4FKEA; Value: 12.4 kΩ; ComponentLink1Description: Datasheet; ComponentLink1URL: http://www.vishay.com/docs/20035/dcrcwe3.pdf; ComponentLink2Description: DigiKey Link; ComponentLink2URL: https://www.digikey.com/en/products/detail/vishay-dale/CRCW060312K4FKEA/1174792; Composition: Thick Film; Device Package: 0603 (1608 Metric); Features: Automotive AEC-Q200; Height - Seated (Max): 0.020" (0.50mm); LastUpdated: 9.02.2024 20:43:05; Lifecycle Status: Active; Minimum Order: 1; Number of Terminations: 2; Operating Temperature: -55°C ~ 155°C; Package / Case: 0603 (1608 Metric); Packaging: TapeAndReel; PartId: 12670; Part Status: Active; Price: 0.01; Ratings: AEC-Q200; Series: CRCW; Size / Dimension: 0.061" L x 0.033" W (1.55mm x 0.85mm); Supplier 1: DigiKey; Supplier Part Number 1: 541-12.4KHCT-ND; Supplier Device Package: 0603; Tolerance: ±1%
U10 = W5500: Hardwired TCP/IP embedded Ethernet controller; Availability: Unavailable; MP: W5500; Value: *; Price: None; Package: None
Y1 = STDCSW5-25M: CRYSTAL 25.0000MHZ 8PF SMD; Manufacturer: NDK America, Inc.; ESR (Equivalent Series Resistance): 60 Ohms; Frequency Stability: ±25ppm; Frequency Tolerance: ±15ppm; Operating Mode: Fundamental; Part Number: STDCSW5-25M; ComponentLink1Description: Datasheet; ComponentLink1URL: https://mm.digikey.com/Volume0/opasdata/d220001/medias/images/896/644-1059_4.jpg; ComponentLink2Description: DigiKey Link; ComponentLink2URL: https://www.digikey.com/en/products/detail/ndk-america-inc/STDCSW5-25M/5022957; Frequency: 25 MHz; Height - Seated (Max): 0.022" (0.55mm); LastUpdated: 3.06.2024 20:02:17; Lifecycle Status: Active; Load Capacitance: 8pF; Minimum Order: 1; Mounting Type: Surface Mount; Operating Temperature: -40°C ~ 85°C; Packaging: TapeAndReel; PartId: 885; Price: 0.38; Series: NX2520SA; Size / Dimension: 0.098" L x 0.079" W (2.50mm x 2.00mm); Type: MHz Crystal; Value: 25 MHz; Supplier 1: DigiKey; Supplier Part Number 1: 644-STDCSW5-25MCT-ND